# Altium schematic sheet mcu.SchDoc
size A4; SheetNumber: 1; SheetTotal: 1
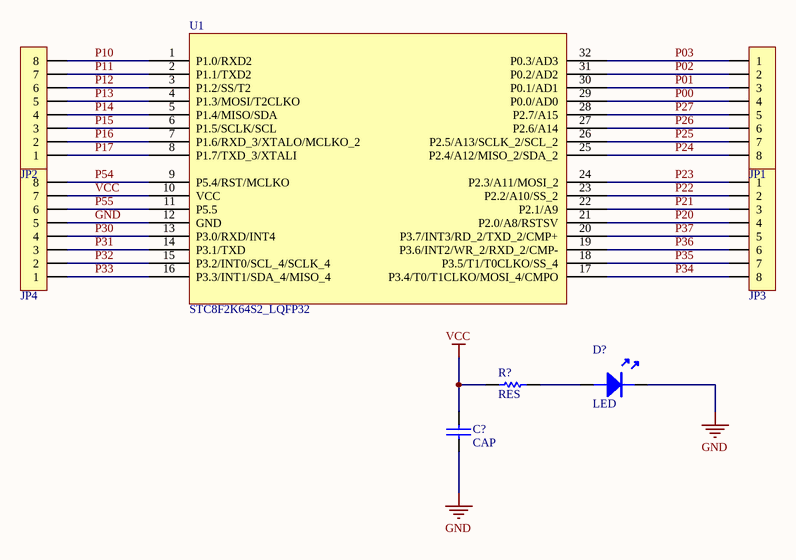
[diagram p0: mcu.SchDoc]

## Parts
C?  CAP  [0603C]
D?  LED  [LED-0603W]
JP1  HDR-1X8  [Pin HDR1X8/2.54mm-S]  (value not drawn)
JP2  HDR-1X8  [Pin HDR1X8/2.54mm-S]  (value not drawn)
JP3  HDR-1X8  [Pin HDR1X8/2.54mm-S]  (value not drawn)
JP4  HDR-1X8  [Pin HDR1X8/2.54mm-S]  (value not drawn)
R?  RES  [0603R]
U1  STC8F2K64S2_LQFP32  [LQFP32]

## Nets
GND: C?.1 D?.K JP4.5 U1.12(GND)
VCC: C?.2 JP4.7 R?.1 U1.10(VCC)
P00: JP1.4 U1.29(P0.0/AD0)
P01: JP1.3 U1.30(P0.1/AD1)
P02: JP1.2 U1.31(P0.2/AD2)
P03: JP1.1 U1.32(P0.3/AD3)
P10: JP2.8 U1.1(P1.0/RXD2)
P11: JP2.7 U1.2(P1.1/TXD2)
P12: JP2.6 U1.3(P1.2/SS/T2)
P13: JP2.5 U1.4(P1.3/MOSI/T2CLKO)
P14: JP2.4 U1.5(P1.4/MISO/SDA)
P15: JP2.3 U1.6(P1.5/SCLK/SCL)
P16: JP2.2 U1.7(P1.6/RXD_3/XTALO/MCLKO_2)
P17: JP2.1 U1.8(P1.7/TXD_3/XTALI)
P20: JP3.4 U1.21(P2.0/A8/RSTSV)
P21: JP3.3 U1.22(P2.1/A9)
P22: JP3.2 U1.23(P2.2/A10/SS_2)
P23: JP3.1 U1.24(P2.3/A11/MOSI_2)
P24: JP1.8 U1.25(P2.4/A12/MISO_2/SDA_2)
P25: JP1.7 U1.26(P2.5/A13/SCLK_2/SCL_2)
P26: JP1.6 U1.27(P2.6/A14)
P27: JP1.5 U1.28(P2.7/A15)
P30: JP4.4 U1.13(P3.0/RXD/INT4)
P31: JP4.3 U1.14(P3.1/TXD)
P32: JP4.2 U1.15(P3.2/INT0/SCL_4/SCLK_4)
P33: JP4.1 U1.16(P3.3/INT1/SDA_4/MISO_4)
P34: JP3.8 U1.17(P3.4/T0/T1CLKO/MOSI_4/CMPO)
P35: JP3.7 U1.18(P3.5/T1/T0CLKO/SS_4)
P36: JP3.6 U1.19(P3.6/INT2/WR_2/RXD_2/CMP-)
P37: JP3.5 U1.20(P3.7/INT3/RD_2/TXD_2/CMP+)
P54: JP4.8 U1.9(P5.4/RST/MCLKO)
P55: JP4.6 U1.11(P5.5)
NetD?_A: D?.A R?.2

## Library data of the parts
C? = CAP: 无极性电容
JP1-JP4 = Header 8: 8P接插件; 版权归属: 封装库来自淘宝 ID：黄晶宝石; BOM名称: 8P接插件; 学习资源: https://shop463601444.taobao.com